# EAGLE schematic Motor_PWM_Anschluss (EAGLE 7.7.0)
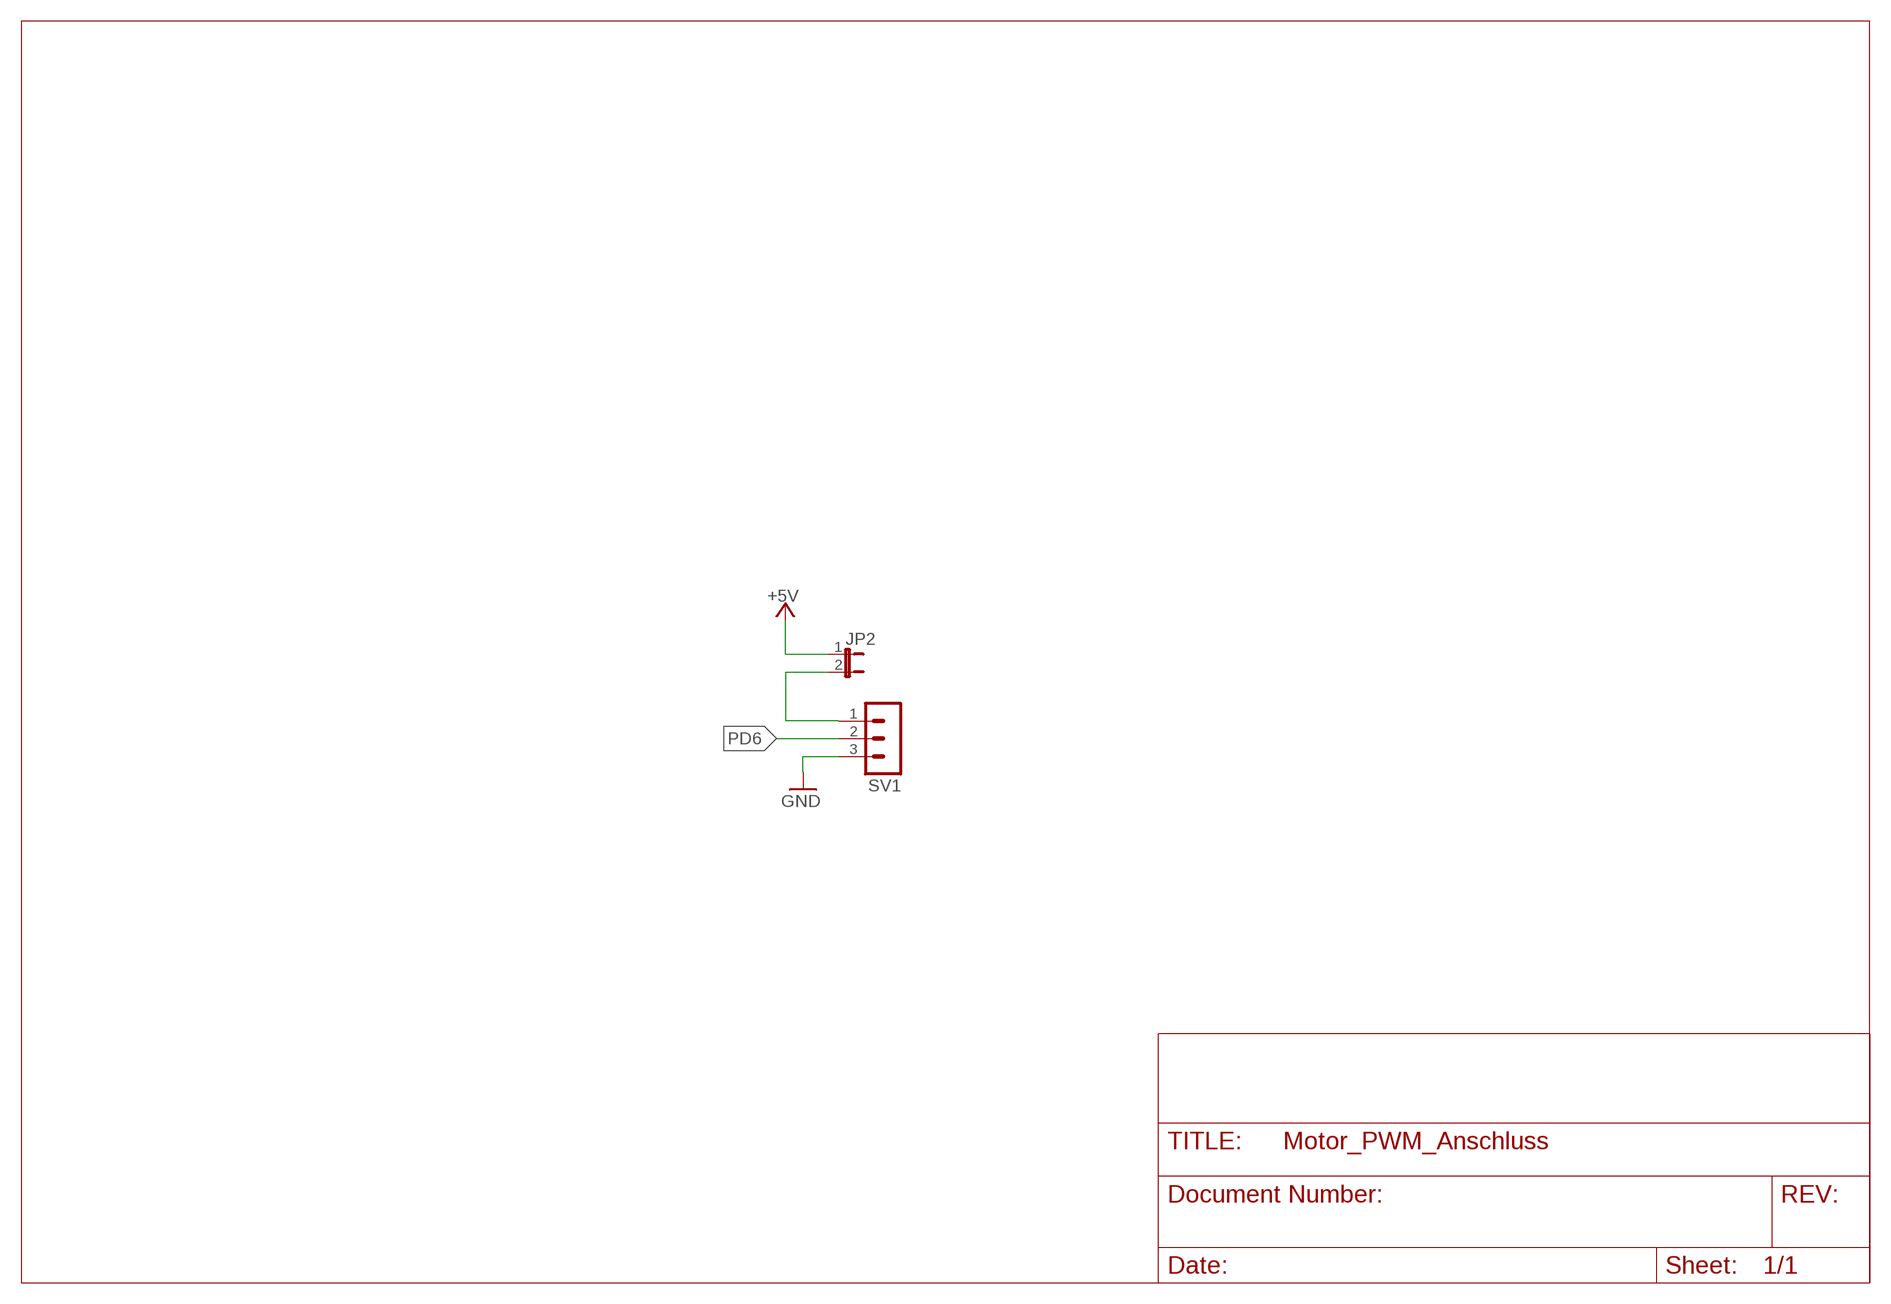
[diagram p0: schematic, sheet 1]

## Parts
JP2  JP1E  [JP1]
SV1  MA03-1  [MA03-1]

## Nets
+5V: JP2.1
GND: SV1.3
N$16: JP2.2 SV1.1
PD6: SV1.2

## Library data of the parts
JP2 = jumper:JP1E: JUMPER
SV1 = con-lstb:MA03-1: PIN HEADER; OC_FARNELL: unknown; OC_NEWARK: unknown